# EAGLE design devre (EAGLE 8.5.1)
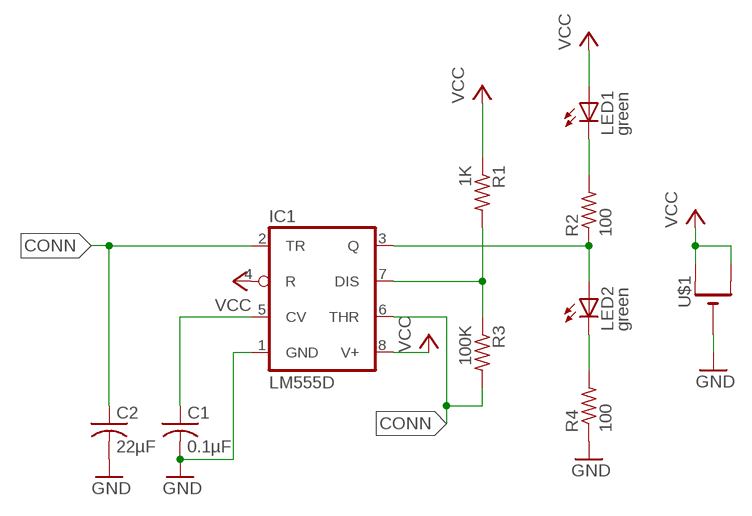
[diagram p0: schematic, sheet 1]

## Parts
C1  0.1µF  C-USC0805  [C0805]
C2  22µF  C-USC0805  [C0805]
IC1  LM555D  [SO08]
LED1  green  LEDCHIP-LED0805  [CHIP-LED0805]
LED2  green  LEDCHIP-LED0805  [CHIP-LED0805]
R1  1K  R-US_R0805  [R0805]
R2  100  R-US_R0805  [R0805]
R3  100K  R-US_R0805  [R0805]
R4  100  R-US_R0805  [R0805]
U$1  CR1220SMT  [CR1220-SMD]

## Nets
CONN: C2.1 IC1.2(TR) IC1.6(THR) R3.2
GND: C1.2 C2.2 IC1.1(GND) R4.1 U$1.-
N$1: C1.1 IC1.5(CV)
N$3: IC1.7(DIS) R1.2 R3.1
N$4: LED1.C R2.2
N$5: IC1.3(Q) LED2.A R2.1
N$6: LED2.C R4.2
VCC: IC1.4(R) IC1.8(V+) LED1.A R1.1 U$1.+$1(+) U$1.+$2(+1)

## Library data of the parts
C1 C2 = adafruit:C-US: CAPACITOR, American symbol
IC1 = adafruit:*555: TIMER Changed DIP package to have round (not oval) pin pads http://www.ladyada.net/library/pcb/eaglelibrary.html
LED1 LED2 = adafruit:LED: LED OSRAM: - CHIPLED LG R971, LG N971, LY N971, LG Q971, LY Q971, LO R971, LY R971 LH N974, LH R974 LS Q976, LO Q976, LY Q976 LO Q996 - Hyper CHIPLED LW Q18S LB Q993, LB Q99A, LB R99A - SideLED LS A670, LO A670, LY A670, LG A670, LP A670 LB A673, LV A673, LT A673, LW A673 LH A674 LY A675 LS A676, LA A676, LO A676, LY A676, LW A676 LS A679, LY A679, LG A679 - Hyper Micro SIDELED® LS Y876, LA Y876, LO Y876, LY Y876 LT Y87S - SmartLED LW L88C, LW L88S LB L89C, LB L89S, LG L890 LS L89K, LO L89K, LY L89K LS L896, LA L896, LO L896, LY L896 - TOPLED LS T670, LO T670, LY T670, LG T670, LP T670 LSG T670, LSP T670, LSY T670, LOP T670, LYG T670 LG T671, LOG T671, LSG T671 LB T673, LV T673, LT T673, LW T673 LH T674 LS T676, LA T676, LO T676, LY T676, LB T676, LH T676, LSB T676, LW T676 LB T67C, LV T67C, LT T67C, LS T67K, LO T67K, LY T67K, LW E67C LS E67B, LA E67B, LO E67B, LY E67B, LB E67C, LV E67C, LT E67C LW T67C LS T679, LY T679, LG T679 LS T770, LO T770, LY T770, LG T770, LP T770 LB T773, LV T773, LT T773, LW T773 LH T774 LS E675, LA E675, LY E675, LS T675 LS T776, LA T776, LO T776, LY T776, LB T776 LHGB T686 LT T68C, LB T68C - Hyper Mini TOPLED® LB M676 - Mini TOPLED Santana® LG M470 LS M47K, LO M47K, LY M47K Source: http://www.osram.convergy.de/
R1-R4 = adafruit:R-US_: RESISTOR, American symbol
U$1 = adafruit:CR1220: CR1216/CR1220/CR1225 12mm 3V lithium coin cell Great for battery packup. Both SMT and THM holders. Note the THM package has the ground pads on both sides of the PCB so that the masks are the same - this reduces the cost

## Net classes
0 default: width 0.305 mm, drill 0.508 mm, clearance 0.254 mm

## Board
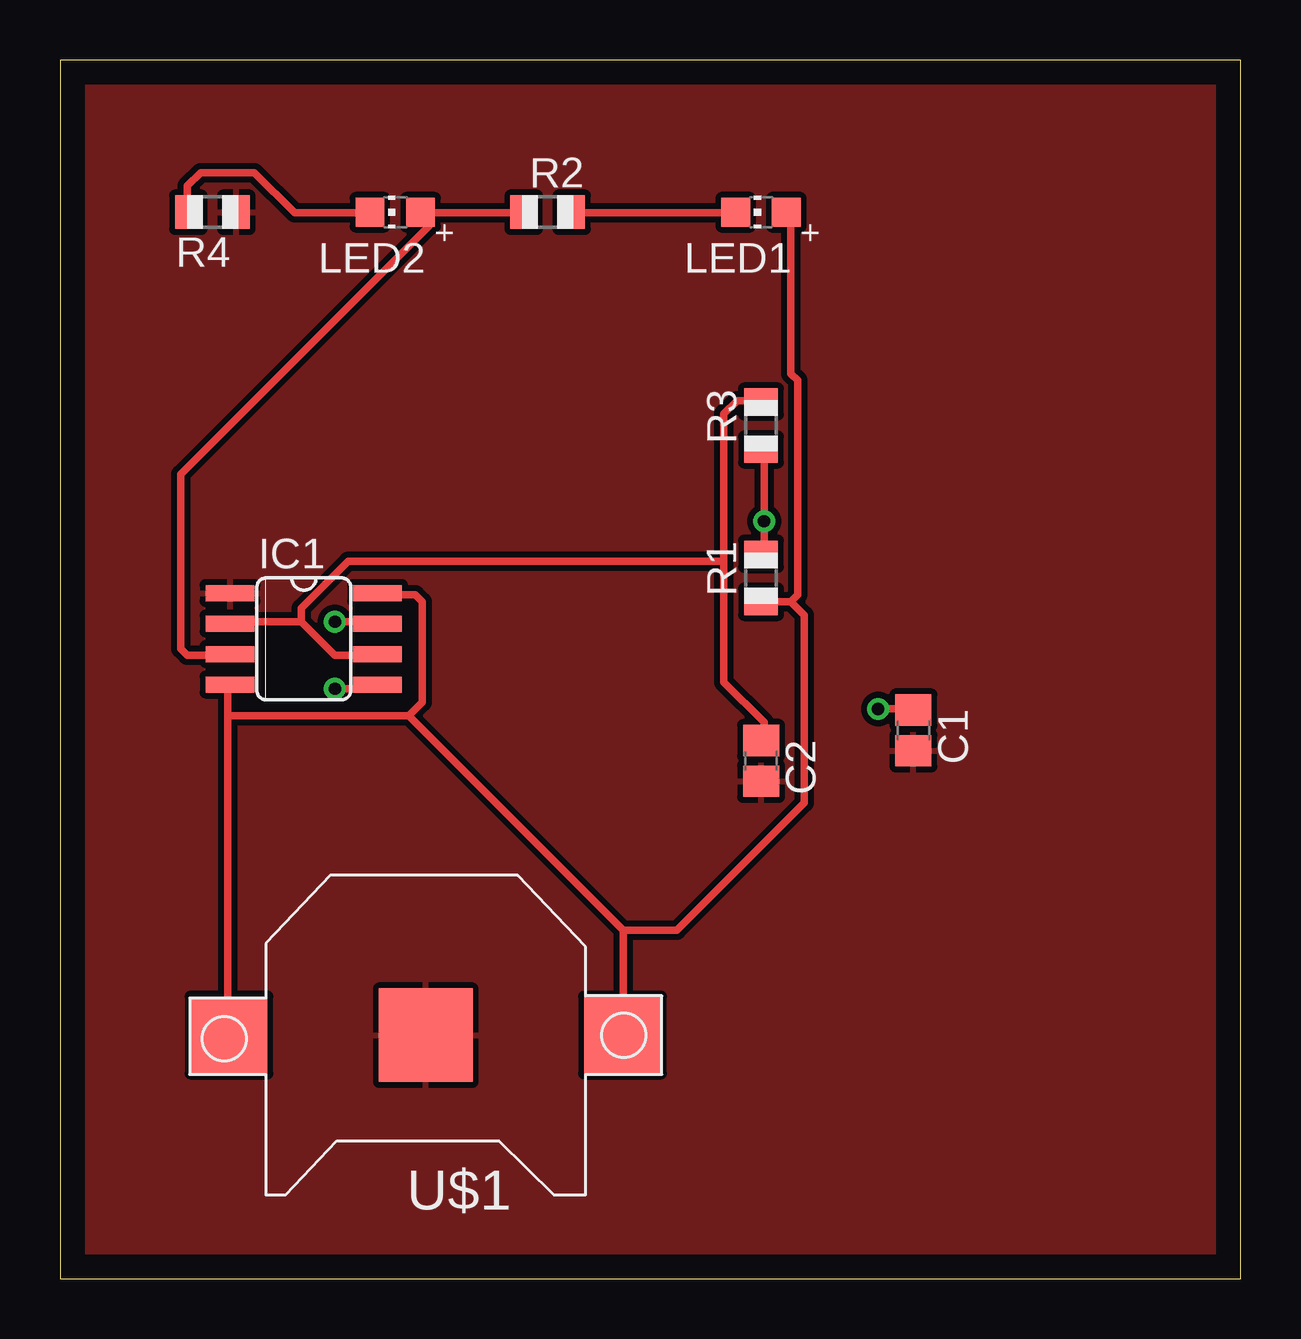
[diagram p1: board, top side]
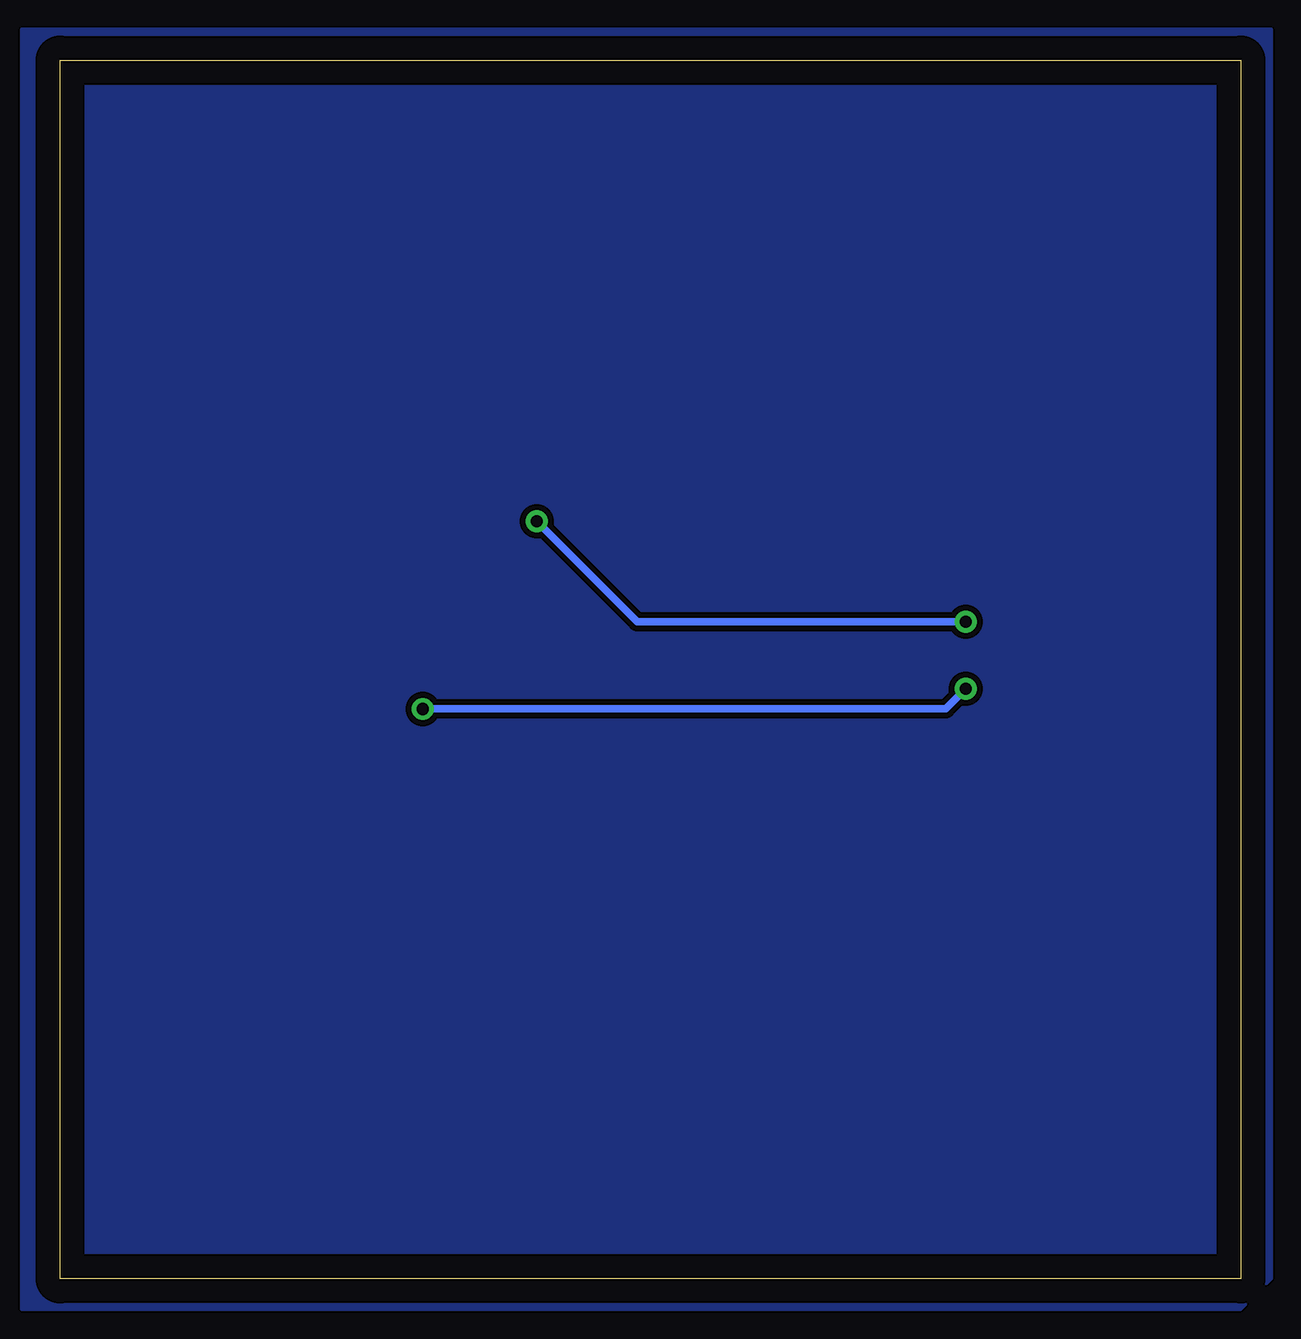
[diagram p2: board, bottom side, seen from below]

Size 49.2 x 50.79 mm. Coordinates in mm from the lower left corner, seen from the top.
Outline: 0,0 49.2,0 49.2,50.79 0,50.79 0,0
Copper layers (1*16): Top 0.035mm / dielectric 1.5mm / Bottom 0.035mm
Design rules "default": minimum track width 6mil, minimum drill 0.35mm, track to track 6mil, track to pad 6mil, pad to pad 6mil, via to via 6mil, smd to smd 6mil, copper to edge 40mil, drill to drill 6mil, minimum pad ring 10mil, minimum via ring 8mil, stop-mask expansion 4mil, vias tented up to drill 0mil, thermal gap 10mil

### Footprints (pad centres in the part's own frame; a part is rotated, then mirrored left to right if it is on the bottom)
C0805 = smd 1.3 x 1.5: 1 -0.85,0; 2 0.85,0
SO08 = smd 0.66 x 2.032: 1 -1.905,-3.073; 2 -0.635,-3.073; 3 0.635,-3.073; 4 1.905,-3.073; 5 1.905,3.073; 6 0.635,3.073; 7 -0.635,3.073; 8 -1.905,3.073
CHIP-LED0805 = smd 1.2 x 1.2: A 0,-1.05; C 0,1.05
R0805 = smd 1.1 x 1.4: 1 -1,0; 2 1,0
CR1220-SMD = smd 3.2 x 3.2: +$1 -8.2,0; +$2 8.2,0 | smd 3.9 x 3.9: - 0,0

### Placement (x,y rotation side)
C1  35.56,22.86 270 top
C2  29.21,21.59 270 top
IC1  10.16,26.67 270 top
LED1  29.21,44.45 90 top
LED2  13.97,44.45 90 top
R1  29.21,29.21 90 top
R2  20.32,44.45 0 top
R3  29.21,35.56 90 top
R4  6.35,44.45 180 top
U$1  15.24,10.16 180 top

### Tracks (layer width: path | path; a pad name or v marks a point on that pad's centre or on a via)
CONN
  Top 0.305: 10.06,27.38 7.26,27.38 IC1.2 | 10.06,27.38 11.46,25.98 13.13,25.98 IC1.6 | 27.66,29.9 27.66,24.87 29.34,23.19 29.34,22.63 C2.1 | 27.66,29.9 27.66,36.04 28.22,36.6 29.06,36.6 R3.2 | 10.06,27.38 10.06,27.94 12.01,29.9 27.66,29.9
GND
  pour Top: 0,50.8 49.53,50.8 49.53,0 0,0
  pour Bottom: -1.27,52.07 50.8,52.07 50.8,-1.27 0,-1.27 -1.27,0
N$1  (via drill 0.51)
  Top 0.305: v34.09,23.75 35.48,23.75 C1.1 | v11.46,24.59 13.13,24.59 IC1.5
  Bottom 0.305: v34.09,23.75 12.29,23.75 v11.46,24.59
N$3  (via drill 0.51)
  Top 0.305: R1.2 29.34,30.45 v29.34,31.57 29.34,34.37 R3.1 | v11.46,27.38 13.13,27.38 IC1.7
  Bottom 0.305: v11.46,27.38 25.15,27.38 v29.34,31.57
N$4
  Top 0.305: LED1.C 27.94,44.42 21.51,44.42 R2.2
N$5
  Top 0.305: 15.37,44.42 19.28,44.42 R2.1 | 15.37,44.42 15.09,44.42 LED2.A 15.37,44.42 | 15.37,44.42 15.37,43.87 5.03,33.53 5.03,26.26 5.31,25.98 6.99,25.98 IC1.3
N$6
  Top 0.305: LED2.C 12.85,44.42 9.78,44.42 8.1,46.1 5.87,46.1 5.31,45.54 5.31,44.7 R4.2
VCC
  Top 0.305: 30.45,28.22 30.73,28.5 30.73,37.44 30.45,37.72 30.45,44.42 LED1.A | 30.45,28.22 29.34,28.22 R1.1 | 6.99,23.47 6.99,10.34 U$1.+$2 | 6.99,23.47 6.99,24.59 IC1.4 | 14.53,23.47 15.09,24.03 15.09,28.22 14.81,28.5 13.41,28.5 IC1.8 | 6.99,23.47 14.53,23.47 | 23.47,14.53 23.47,10.34 U$1.+$1 | 14.53,23.47 23.47,14.53 | 30.45,28.22 31.01,27.66 31.01,19.84 25.7,14.53 23.47,14.53